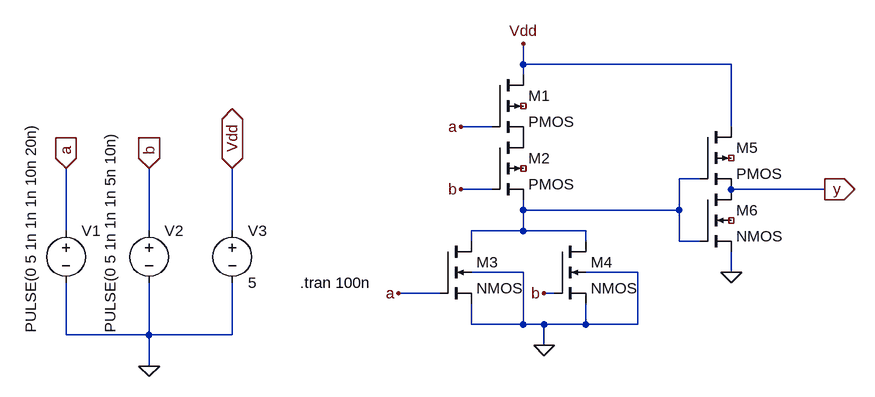
[diagram p0: schematic OR.asc]
OR.asc, the LTspice schematic file:
Version 4
SHEET 1 1276 680
WIRE 752 112 752 80
WIRE 1072 112 752 112
WIRE 752 128 752 112
WIRE 704 208 656 208
WIRE 1072 208 1072 112
WIRE 1024 288 992 288
WIRE 704 304 656 304
WIRE 1216 304 1072 304
WIRE 752 336 752 320
WIRE 992 336 992 288
WIRE 992 336 752 336
WIRE 48 368 48 272
WIRE 176 368 176 272
WIRE 304 368 304 272
WIRE 752 368 752 336
WIRE 752 368 672 368
WIRE 848 368 752 368
WIRE 672 384 672 368
WIRE 848 384 848 368
WIRE 992 384 992 336
WIRE 1024 384 992 384
WIRE 752 432 672 432
WIRE 928 432 848 432
WIRE 1072 432 1072 400
WIRE 624 464 560 464
WIRE 800 464 784 464
WIRE 672 512 672 480
WIRE 752 512 752 432
WIRE 752 512 672 512
WIRE 784 512 752 512
WIRE 848 512 848 480
WIRE 848 512 784 512
WIRE 928 512 928 432
WIRE 928 512 848 512
WIRE 48 528 48 448
WIRE 176 528 176 448
WIRE 176 528 48 528
WIRE 304 528 304 448
WIRE 304 528 176 528
WIRE 784 544 784 512
WIRE 176 576 176 528
FLAG 176 576 0
FLAG 48 272 a
IOPIN 48 272 In
FLAG 176 272 b
IOPIN 176 272 In
FLAG 304 272 Vdd
IOPIN 304 272 BiDir
FLAG 784 544 0
FLAG 656 208 a
FLAG 560 464 a
FLAG 656 304 b
FLAG 784 464 b
FLAG 752 80 Vdd
FLAG 1072 432 0
FLAG 1216 304 y
IOPIN 1216 304 Out
SYMBOL voltage 48 352 R0
WINDOW 3 -54 -151 VRight 2
SYMATTR Value PULSE(0 5 1n 1n 1n 10n 20n)
SYMATTR InstName V1
SYMBOL voltage 176 352 R0
WINDOW 3 -60 -137 VRight 2
SYMATTR Value PULSE(0 5 1n 1n 1n 5n 10n)
SYMATTR InstName V2
SYMBOL voltage 304 352 R0
SYMATTR InstName V3
SYMATTR Value 5
SYMBOL pmos4 704 128 R0
SYMATTR InstName M1
SYMBOL pmos4 704 224 R0
SYMATTR InstName M2
SYMBOL nmos4 624 384 R0
SYMATTR InstName M3
SYMBOL nmos4 800 384 R0
SYMATTR InstName M4
SYMBOL pmos4 1024 208 R0
SYMATTR InstName M5
SYMBOL nmos4 1024 304 R0
SYMATTR InstName M6
TEXT 408 448 Left 2 !.tran 100n

The netlist it stands for:
* OR.asc
V1 a 0 PULSE(0 5 1n 1n 1n 10n 20n)
V2 b 0 PULSE(0 5 1n 1n 1n 5n 10n)
V3 Vdd 0 5
M1 Vdd a P001 NC_01 PMOS
M2 P001 b N001 NC_02 PMOS
M3 N001 a 0 0 NMOS
M4 N001 b 0 0 NMOS
M5 Vdd N001 y NC_03 PMOS
M6 y N001 0 NC_04 NMOS
.model NMOS NMOS
.model PMOS PMOS
.lib standard.mos
.tran 100n
.backanno
.end